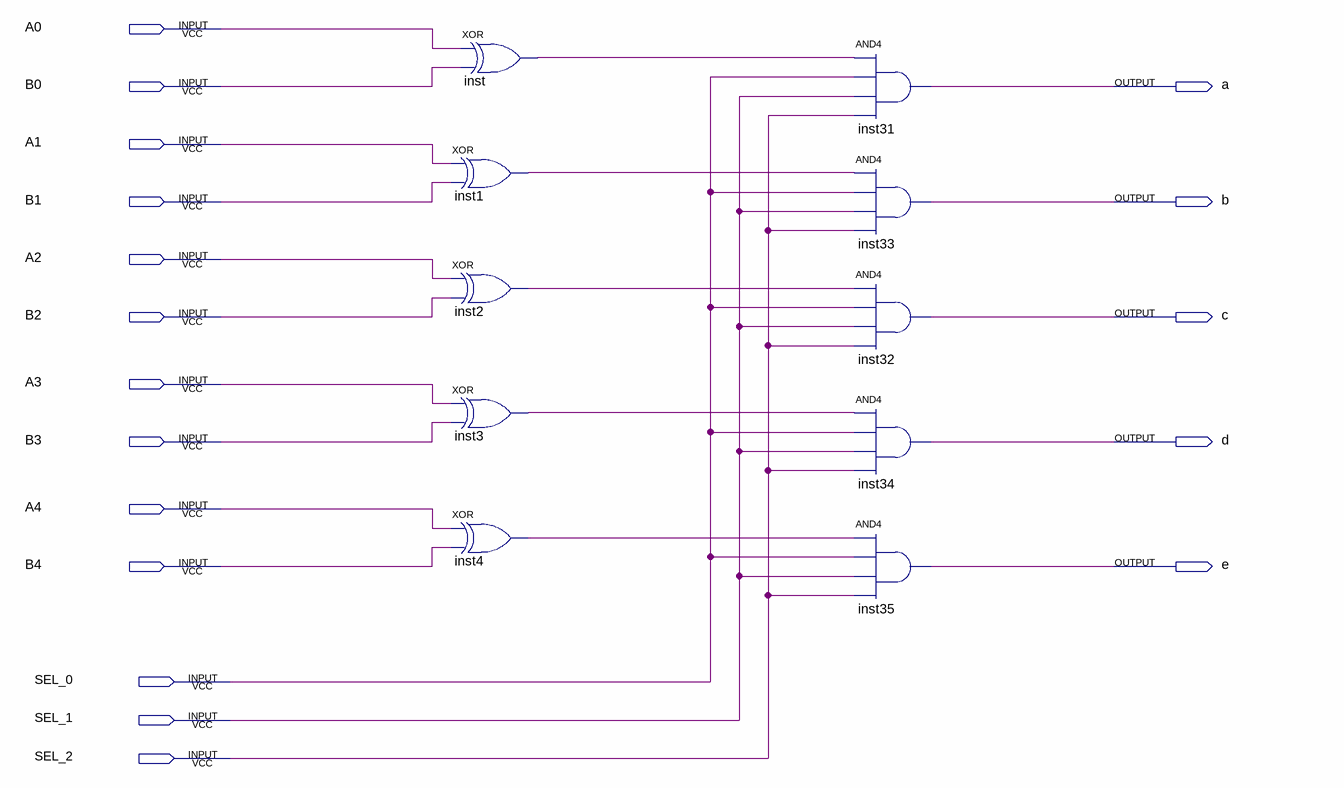
[diagram p0: schematic sheet]
// Quartus schematic Block4.bdf as structural Verilog: 10 symbols, 18 pins
module Block4 (
  input  A0,
  input  B0,
  input  A1,
  input  B1,
  input  A2,
  input  B2,
  input  A3,
  input  B3,
  input  A4,
  input  B4,
  input  SEL_0,
  input  SEL_1,
  input  SEL_2,
  output a,
  output b,
  output c,
  output d,
  output e
);

  wire inst1_out, inst2_out, inst3_out, inst4_out, inst_out;

  xor inst (inst_out, A0, B0);
  xor inst1 (inst1_out, A1, B1);
  xor inst2 (inst2_out, A2, B2);
  xor inst3 (inst3_out, A3, B3);
  xor inst4 (inst4_out, A4, B4);
  and inst31 (a, inst_out, SEL_0, SEL_1, SEL_2);
  and inst33 (b, inst1_out, SEL_0, SEL_1, SEL_2);
  and inst32 (c, inst2_out, SEL_0, SEL_1, SEL_2);
  and inst34 (d, inst3_out, SEL_0, SEL_1, SEL_2);
  and inst35 (e, inst4_out, SEL_0, SEL_1, SEL_2);
endmodule
